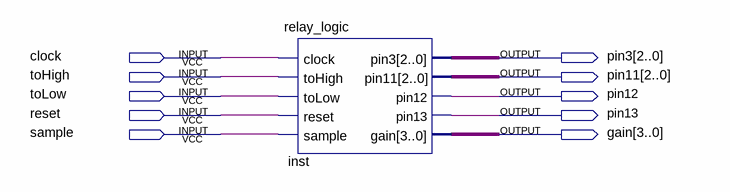
[diagram p0: schematic sheet]
// Quartus schematic test.bdf as structural Verilog: 1 symbols, 10 pins
module test (
  input  clock,
  input  toHigh,
  input  toLow,
  input  reset,
  input  sample,
  output [2:0] pin3,
  output [2:0] pin11,
  output pin12,
  output pin13,
  output [3:0] gain
);

  relay_logic inst (
    .clock(clock), .toHigh(toHigh), .toLow(toLow), .reset(reset), .sample(sample), .pin3(pin3),
    .pin11(pin11), .pin12(pin12), .pin13(pin13), .gain(gain));
endmodule
